# Altium schematic sheet Sheet7.SchDoc
size A4
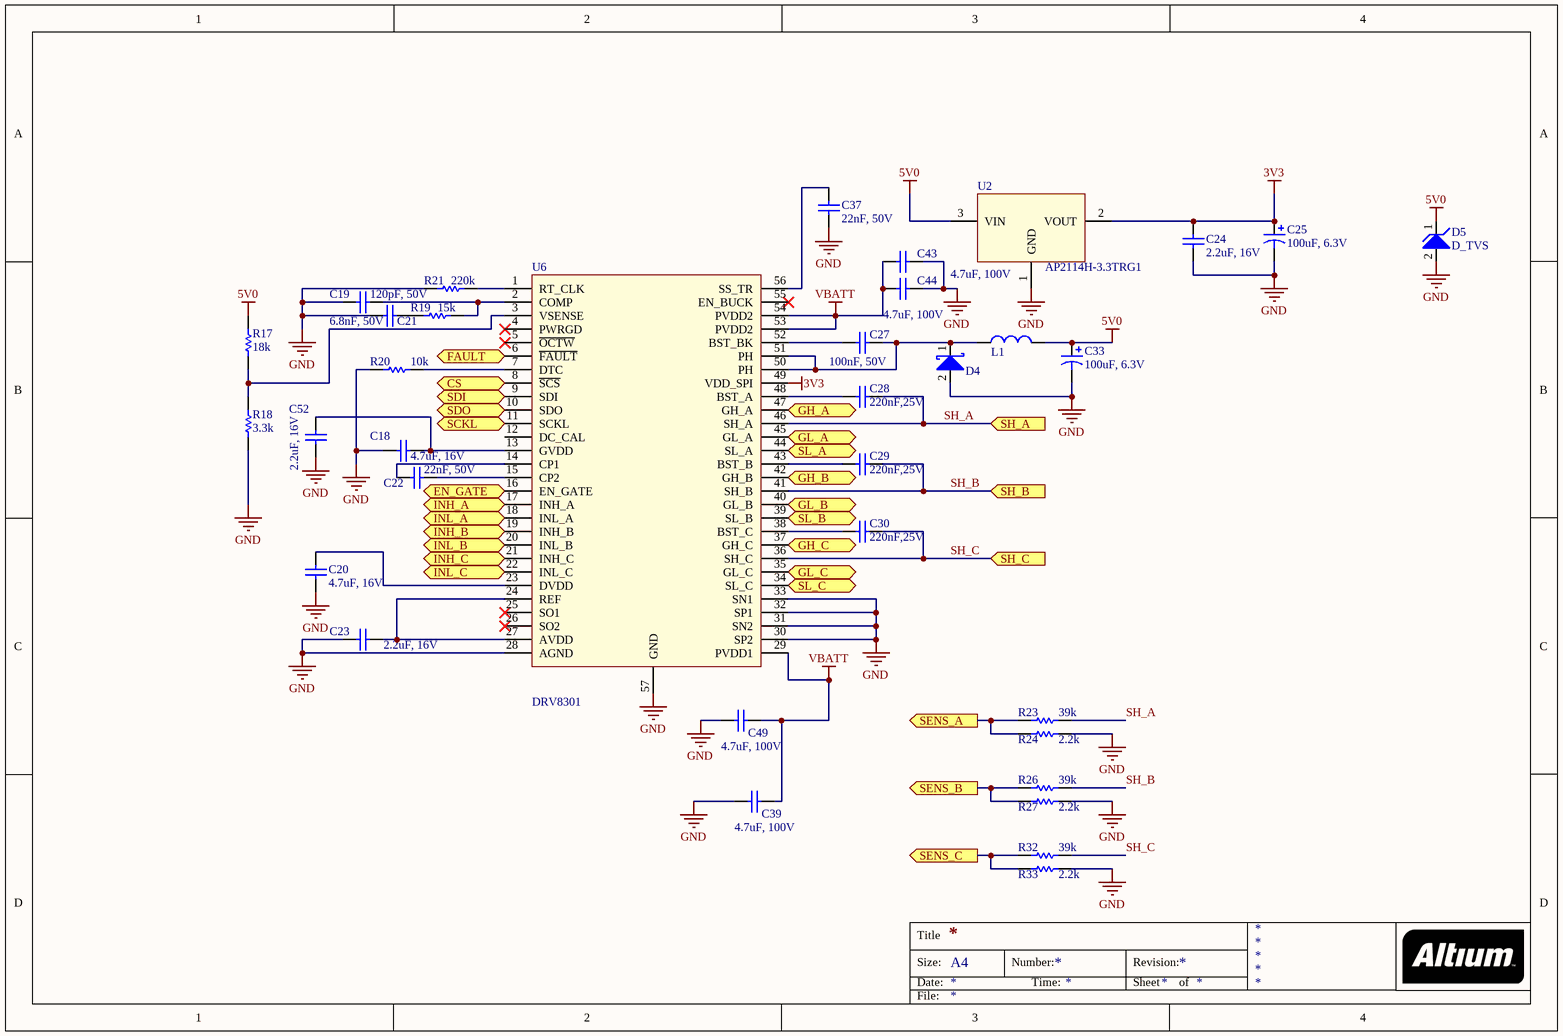
[diagram p0: Sheet7.SchDoc]

## Parts
C18  value 4.7uF, 16V  [SMD-0603 Capacitor]  (hidden comment: CAP)
C19  value 120pF, 50V  [SMD-0603 Capacitor]  (hidden comment: CAP)
C20  value 4.7uF, 16V  [SMD-0603 Capacitor]  (hidden comment: CAP)
C21  value 6.8nF, 50V  [SMD-0603 Capacitor]  (hidden comment: CAP)
C22  value 22nF, 50V  [SMD-0603 Capacitor]  (hidden comment: CAP)
C23  value 2.2uF, 16V  [SMD-0603 Capacitor]  (hidden comment: Voltage important)
C24  value 2.2uF, 16V  [SMD-0603 Capacitor]  (hidden comment: Voltage important)
C25  value 100uF, 6.3V  [TANT B]  (hidden comment: Voltage important)
C27  value 100nF, 50V  [SMD-0603 Capacitor]  (hidden comment: Voltage important)
C28  value 220nF,25V  [SMD-0603 Capacitor]  (hidden comment: Voltage important)
C29  value 220nF,25V  [SMD-0603 Capacitor]  (hidden comment: Voltage important)
C30  value 220nF,25V  [SMD-0603 Capacitor]  (hidden comment: Voltage important)
C33  value 100uF, 6.3V  [TANT B]  (hidden comment: Voltage important)
C37  value 22nF, 50V  [SMD-0603 Capacitor]  (hidden comment: CAP)
C39  value 4.7uF, 100V  [SMD-1206 Capacitor]  (hidden comment: CAP)
C43  value 4.7uF, 100V  [SMD-1206 Capacitor]  (hidden comment: CAP)
C44  value 4.7uF, 100V  [SMD-1206 Capacitor]  (hidden comment: CAP)
C49  value 4.7uF, 100V  [SMD-1206 Capacitor]  (hidden comment: CAP)
C52  value 2.2uF, 16V  [SMD-0603 Capacitor]  (hidden comment: Voltage important)
D4  Voltage and current important  [SOD-123W]  (value not drawn)
D5  D_TVS  [DO-214AC]
L1  COIL  [HCM0503]  (value not drawn)
R17  18k  [SMD-0603 Resistor]
R18  3.3k  [SMD-0603 Resistor]
R19  15k  [SMD-0603 Resistor]
R20  10k  [SMD-0603 Resistor]
R21  220k  [SMD-0603 Resistor]
R23  39k  [SMD-0603 Resistor]
R24  2.2k  [SMD-0603 Resistor]
R26  39k  [SMD-0603 Resistor]
R27  2.2k  [SMD-0603 Resistor]
R32  39k  [SMD-0603 Resistor]
R33  2.2k  [SMD-0603 Resistor]
U2  Manufacturer Part Number: AP2114H-3.3TRG1  [SOT230P700X180-4N]  (hidden comment: 3.3V)
U6  DRV8301  [SOP127P600-8N]

## Ports
CS (in), EN_GATE (in), FAULT (out), GH_A (out), GH_B (out), GH_C (out), GL_A (out), GL_B (out), GL_C (out), INH_A (in), INH_B (in), INH_C (in), INL_A (in), INL_B (in), INL_C (in), SCKL (in), SDI (in), SDO (in), SENS_A (out), SENS_B (out), SENS_C (out), SH_A (in), SH_B (in), SH_C (in), SL_A (in), SL_B (in), SL_C (in)

## Nets
3V3: C24.2 C25.1 U2.2(VOUT) U6.49(VDD_SPI)
5V0: C33.1 D5.1(K) L1.2 R17.2 U2.3(VIN)
GND: C18.2 C19.1 C20.1 C21.1 C23.1 C24.1 C25.2 C33.2 C37.1 C39.2 C43.1 C44.1 C49.2 C52.1 D4.2(A) D5.2(A) R18.1 R20.1 R21.1 R24.2 R27.2 R33.2 U2.1(GND) U6.28(AGND) U6.30(SP2) U6.31(SN2) U6.32(SP1) U6.33(SN1) U6.57(GND)
VBATT: C39.1 C43.2 C44.2 C49.1 U6.29(PVDD1) U6.53(PVDD2) U6.54(PVDD2)
CS: U6.8(~{SCS}) ; port CS
EN_GATE: U6.16(EN_GATE) ; port EN_GATE
FAULT: U6.6(~{FAULT}) ; port FAULT
GH_A: U6.47(GH_A) ; port GH_A
GH_B: U6.42(GH_B) ; port GH_B
GH_C: U6.37(GH_C) ; port GH_C
GL_A: U6.45(GL_A) ; port GL_A
GL_B: U6.40(GL_B) ; port GL_B
GL_C: U6.35(GL_C) ; port GL_C
INH_A: U6.17(INH_A) ; port INH_A
INH_B: U6.19(INH_B) ; port INH_B
INH_C: U6.21(INH_C) ; port INH_C
INL_A: U6.18(INL_A) ; port INL_A
INL_B: U6.20(INL_B) ; port INL_B
INL_C: U6.22(INL_C) ; port INL_C
SCKL: U6.11(SCKL) ; port SCKL
SDI: U6.9(SDI) ; port SDI
SDO: U6.10(SDO) ; port SDO
SENS_A: R23.1 R24.1 ; port SENS_A
SENS_B: R26.1 R27.1 ; port SENS_B
SENS_C: R32.1 R33.1 ; port SENS_C
SH_A: C28.2 R23.2 U6.46(SH_A) ; port SH_A
SH_B: C29.2 R26.2 U6.41(SH_B) ; port SH_B
SH_C: C30.2 R32.2 U6.36(SH_C) ; port SH_C
SL_A: U6.44(SL_A) ; port SL_A
SL_B: U6.39(SL_B) ; port SL_B
SL_C: U6.34(SL_C) ; port SL_C
NetC18_1: C18.1 C52.2 U6.13(GVDD)
NetC19_2: C19.2 R19.2 U6.2(COMP)
NetC20_2: C20.2 U6.23(DVDD)
NetC21_2: C21.2 R19.1
NetC22_1: C22.1 U6.14(CP1)
NetC22_2: C22.2 U6.15(CP2)
NetC23_2: C23.2 U6.24(REF) U6.27(AVDD)
NetC27_1: C27.1 U6.52(BST_BK)
NetC27_2: C27.2 D4.1(K) L1.1 U6.50(PH) U6.51(PH)
NetC28_1: C28.1 U6.48(BST_A)
NetC29_1: C29.1 U6.43(BST_B)
NetC30_1: C30.1 U6.38(BST_C)
NetC37_2: C37.2 U6.56(SS_TR)
NetR17_1: R17.1 R18.2 U6.3(VSENSE)
NetR20_2: R20.2 U6.7(DTC)
NetR21_2: R21.2 U6.1(RT_CLK)

Not connected (* = marked no-connect by the designer): U6 4(PWRGD)* 5(~{OCTW})* 12(DC_CAL) 25(SO1)* 26(SO2)* 55(EN_BUCK)*

## Notes on the sheet
- Title
- Size:
- Date:
- A4
- Number:
- Time:
- Revision:
- Sheet
- of
- File:

## Library data of the parts
C18 C20 = 25: CAP 4.7u, 16V, 0603; Manufacturer Part Number: C1608X6S1C475K080AC; Manufacturer: TDK Corporation; ID: 25; Place (YES/NO): YES
C19 = 4: CAP 120p, 50V, 0603; Manufacturer Part Number: GRM39C121J50; Manufacturer: Murata Electronics North America; ID: 4; Place (YES/NO): YES
C21 = 5: CAP 6.8n, 50V, 0603; Manufacturer Part Number: GRM18R71H682KA01J; Manufacturer: Murata Electronics North America; ID: 5; Place (YES/NO): YES
C22 C37 = 6: CAP 22n, 50V, 0603; Manufacturer Part Number: GRM18F51H223ZA01D; Manufacturer: Murata Electronics North America; ID: 6; Place (YES/NO): YES
C23 C24 C52 = 9: CAP 2.2u, 16V, 0603; Manufacturer Part Number: C1608X5R1C225M; Manufacturer: TDK Corporation; ID: 9; Place (YES/NO): YES
C25 C33 = 12: CAP 100u, 6.3V; Manufacturer Part Number: TPSB107K006R0400; Manufacturer: AVX Corporation; ID: 12; Place (YES/NO): YES
C27 = 7: CAP 100n, 50V, 0603; Manufacturer Part Number: 06035C104JAT2A; Manufacturer: AVX Corporation; ID: 7; Place (YES/NO): YES
C28-C30 = 8: CAP 220n, 25V, 0603; Manufacturer Part Number: TMK107B7224KA-T; Manufacturer: Taiyo Yuden; ID: 8; Place (YES/NO): YES
C39 C43 C44 C49 = 23: 4.7µF 100V Ceramic Capacitor X7S 1206; Manufacturer Part Number: 12061Z475MAT2A; Manufacturer: AVX Corporation; ID: 23; Place (YES/NO): YES
D4 = 4: Shottky 60V 2A; Manufacturer Part Number: PMEG6020ER-115; Manufacturer: NXP Semiconductors; ID: 4; Place (YES/NO): YES
D5 = 5: TVS diode 5V; Manufacturer Part Number: SMAJ5.0A; Manufacturer: Littelfuse Inc.; ID: 5; Place (YES/NO): YES; Value: 5V
L1 = 7: FIXED IND 22UH 1.9A 270 MOHM SMD; Manufacturer Part Number: HCM0503-220-R; Manufacturer: Eaton; ID: 7; Value: 22µH; Place (YES/NO): YES
R17 = 7: R 18k, 0603; Manufacturer Part Number: RK73H1JTTD1802F; Manufacturer: KOA Speer; ID: 7; Place (YES/NO): YES; Value: 18k
R18 = 4: R 3.3k, 0603; Manufacturer Part Number: RK73H1JTTD3301F; Manufacturer: KOA Speer; ID: 4; Place (YES/NO): YES; Value: 3.3k
R19 = 6: R 15k, 0603; Manufacturer Part Number: RK73H1JTTD1502F; Manufacturer: KOA Speer; ID: 6; Place (YES/NO): YES; Value: 15k
R20 = 5: R 10k, 0603; Manufacturer Part Number: RK73H1JTTD1002F; Manufacturer: KOA Speer; ID: 5; Place (YES/NO): YES; Value: 10k
R21 = 9: R 220k, 0603; Manufacturer Part Number: RK73H1JTTD2203F; Manufacturer: KOA Speer; ID: 9; Place (YES/NO): YES; Value: 220k
R23 R26 R32 = 8: R 39k, 0603; Manufacturer Part Number: ERJ-3EKF3902V; Manufacturer: Panasonic Electronic Components; ID: 8; Place (YES/NO): YES; Value: 39k
R24 R27 R33 = 3: R 2.2k, 0603; Manufacturer Part Number: RK73H1JTTD2201F; Manufacturer: KOA Speer; ID: 3; Place (YES/NO): YES; Value: 2.2k
U2 = 3: VREG LDO; Manufacturer: Diodes Incorporated; ID: 3; Place (YES/NO): YES; Value: 3.3V
U6 = 21: IC MOTOR CONTROLLER SPI 56HTSSOP; Manufacturer Part Number: DRV8301DCA; Manufacturer: Texas Instruments; ID: 21; Value: MOSFET Driver; Place (YES/NO): YES